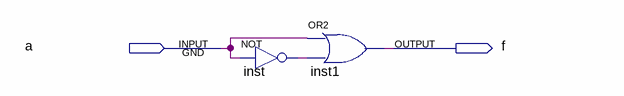
[diagram p0: schematic sheet]
// Quartus schematic 2-1-2-after.bdf as structural Verilog: 2 symbols, 2 pins
module \2-1-2-after  (
  input  a,
  output f
);

  wire inst_out;

  not inst (inst_out, a);
  or inst1 (f, a, inst_out);
endmodule
